# Altium schematic sheet IO.SchDoc
size A4
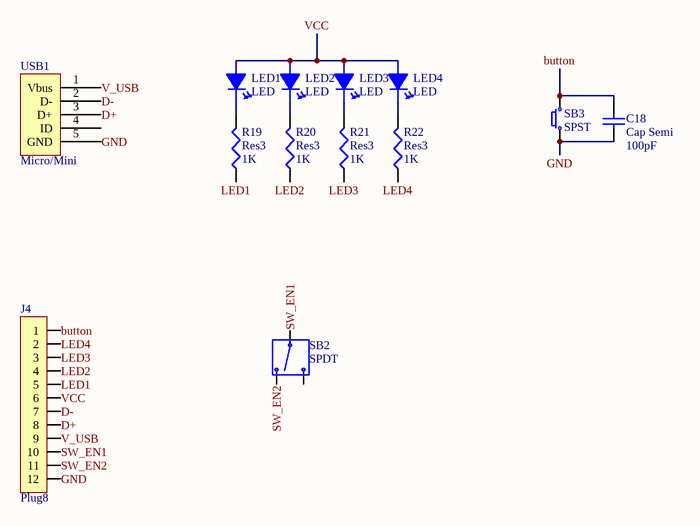
[diagram p0: IO.SchDoc]

## Parts
C18  Cap Semi  value 100pF  [1608[0603]]
J4  Plug8  [FPC0.5-12PS]
LED1  LED  [SMD-0603_LED]
LED2  LED  [SMD-0603_LED]
LED3  LED  [SMD-0603_LED]
LED4  LED  [SMD-0603_LED]
R19  Res3  value 1K  [J1-0603]
R20  Res3  value 1K  [J1-0603]
R21  Res3  value 1K  [J1-0603]
R22  Res3  value 1K  [J1-0603]
SB2  SPDT  [Slide_switch 3.5*8.5]
SB3  SPST  [TACK-SW_SMD 2P 4x3mm_2]
USB1  Micro/Mini  [USB_Micro-B_S_DIP_180]

## Nets
button: C18.2 J4.1 SB3.1
D+: J4.8 USB1.3(D+)
D-: J4.7 USB1.2(D-)
GND: C18.1 J4.12 SB3.2 USB1.5(GND)
LED1: J4.5 R19.1
LED2: J4.4 R20.1
LED3: J4.3 R21.1
LED4: J4.2 R22.1
SW_EN1: J4.10 SB2.2
SW_EN2: J4.11 SB2.3
V_USB: J4.9 USB1.1(Vbus)
VCC: J4.6 LED1.1 LED2.1 LED3.1 LED4.1
NetLED1_2: LED1.2 R19.2
NetLED2_2: LED2.2 R20.2
NetLED3_2: LED3.2 R21.2
NetLED4_2: LED4.2 R22.2

Not connected (* = marked no-connect by the designer): SB2 1; USB1 4(ID)

## Library data of the parts
C18 = Cap Semi: Capacitor (Semiconductor SIM Model); Published: 8-Jun-2000; LatestRevisionDate: 29-May-2009; LatestRevisionNote: IPC-7351 Footprint Added.; PackageReference: C1206; Publisher: Altium Limited; PackageDescription: Chip Capacitor
J4 = Plug12
R19-R22 = Res3: Resistor; Published: 8-Jun-2000; LatestRevisionDate: 29-May-2009; LatestRevisionNote: IPC-7351 Footprint Added.; PackageReference: J1-0603; Publisher: Altium Limited; PackageDescription: Chip Resistor
SB2 = Switch_Button2
SB3 = Switch_Button1
USB1 = USB2